# Altium schematic sheet mcu.SchDoc
size A4; SheetNumber: 1; SheetTotal: 4
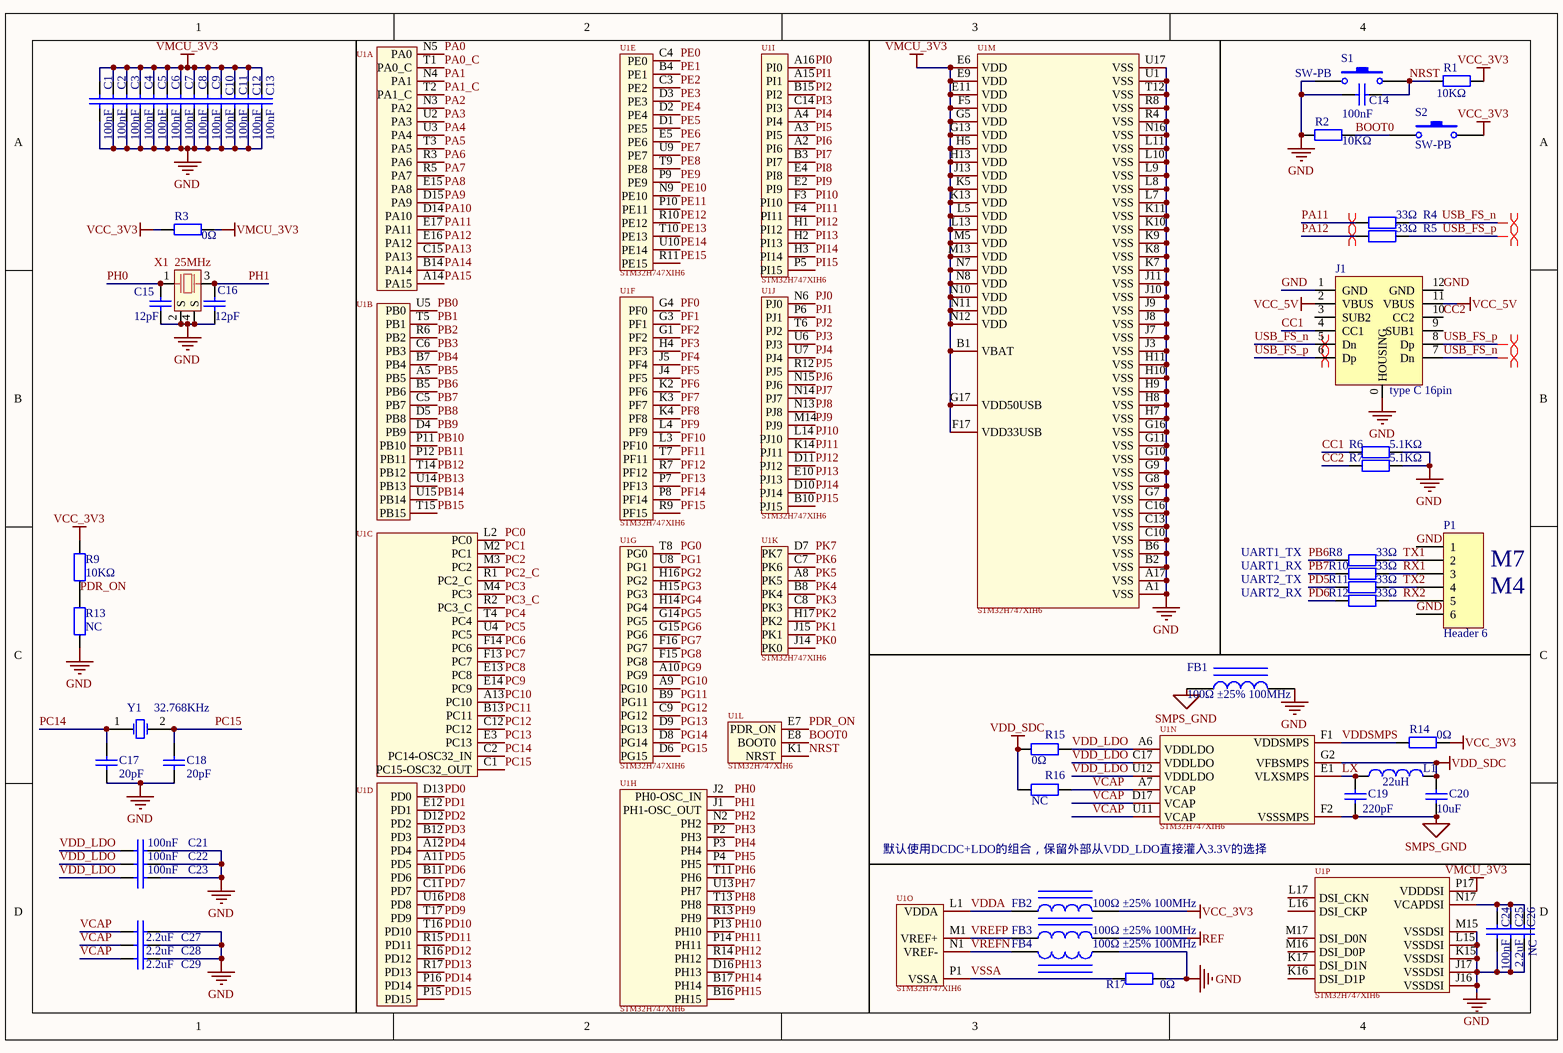
[diagram p0: mcu.SchDoc]

## Parts
(Parts that share a designator on the sheet are numbered #1, #2 ... from top to bottom, then left to right.)
C1  100nF  [0201]
C2  100nF  [0201]
C3  100nF  [0201]
C4  100nF  [0201]
C5  100nF  [0201]
C6  100nF  [0201]
C7  100nF  [0201]
C8  100nF  [0201]
C9  100nF  [0201]
C10  100nF  [0201]
C11  100nF  [0201]
C12  100nF  [0201]
C13  100nF  [0201]
C14  100nF  [0402_C]
C15  12pF  [0402_C]
C16  12pF  [0402_C]
C17  20pF  [0402_C]
C18  20pF  [0402_C]
C19  220pF  [0402_C]
C20  10uF  [0603_C]
C21  100nF  [0402_C]
C22  100nF  [0402_C]
C23  100nF  [0402_C]
C24  100nF  [0402_C]
C25  2.2uF  [0402_C]
C26  NC  [0402_C]
C27  2.2uF  [0402_C]
C28  2.2uF  [0402_C]
C29  2.2uF  [0402_C]
FB1  100Ω ±25% 100MHz  [0805_L]
FB2  100Ω ±25% 100MHz  [0805_L]
FB3  100Ω ±25% 100MHz  [0805_L]
FB4  100Ω ±25% 100MHz  [0805_L]
J1  type C 16pin  [USB type C  16pin]
L1  value 22uH  [IND-SMD_L2.5-W2.0_YXMBL252010P]  (hidden comment: Inductor)
P1  Header 6  [HDR1X6]
R1  10KΩ  [0402_R]
R2  10KΩ  [0402_R]
R3  0Ω  [0402_R]
R4  33Ω  [0402_R]
R5  33Ω  [0402_R]
R6  5.1KΩ  [0402_R]
R7  5.1KΩ  [0402_R]
R8  33Ω  [0805_R]
R9  10KΩ  [0402_R]
R10  33Ω  [0805_R]
R11  33Ω  [0805_R]
R12  33Ω  [0805_R]
R13  NC  [0402_R]
R14  0Ω  [0402_R]
R15  0Ω  [0805_R]
R16  NC  [0805_R]
R17  0Ω  [0402_R]
S1  SW-PB  [SW-3*4-2P]
S2  SW-PB  [SW-3*4-2P]
U1#1  STM32H747XIH6  [TFBGA-265_L14.0-W14.0-P0.80-TL_STM32H743XIH6]  (value not drawn)  (parts A,B,C,D,E,F,G,H,I,J,K of 13)
U1#2  STM32H747XIH6  [TFBGA-265_L14.0-W14.0-P0.80-TL_STM32H743XIH6]  (parts L,M,N,O,P of 16)
X1  25MHz  [3225]
Y1  32.768KHz  [SMD-3215_2P FC - 135]

## Nets
GND: C1.1 C2.1 C3.1 C4.1 C5.1 C6.1 C7.1 C8.1 C9.1 C10.1 C11.1 C12.1 C13.1 C14.1 C15.2 C16.2 C17.1 C18.1 C21.2 C22.2 C23.2 C24.1 C25.1 C26.1 C27.2 C28.2 C29.2 FB1.2 FB4.2 J1.0(HOUSING) J1.1(GND) J1.12(GND) P1.1 P1.6 R2.1 R6.2 R7.2 R13.1 R17.1 S1.1 U1#2.A1(VSS) U1#2.A17(VSS) U1#2.B2(VSS) U1#2.B6(VSS) U1#2.C10(VSS) U1#2.C13(VSS) U1#2.C16(VSS) U1#2.G7(VSS) U1#2.G8(VSS) U1#2.G9(VSS) U1#2.G10(VSS) U1#2.G11(VSS) U1#2.G16(VSS) U1#2.H7(VSS) U1#2.H8(VSS) U1#2.H9(VSS) U1#2.H10(VSS) U1#2.H11(VSS) U1#2.J3(VSS) U1#2.J7(VSS) U1#2.J8(VSS) U1#2.J9(VSS) U1#2.J10(VSS) U1#2.J11(VSS) U1#2.J16(VSSDSI) U1#2.J17(VSSDSI) U1#2.K7(VSS) U1#2.K8(VSS) U1#2.K9(VSS) U1#2.K10(VSS) U1#2.K11(VSS) U1#2.K15(VSSDSI) U1#2.L7(VSS) U1#2.L8(VSS) U1#2.L9(VSS) U1#2.L10(VSS) U1#2.L11(VSS) U1#2.L15(VSSDSI) U1#2.M15(VSSDSI) U1#2.N16(VSS) U1#2.R4(VSS) U1#2.R8(VSS) U1#2.T12(VSS) U1#2.U1(VSS) U1#2.U17(VSS) X1.2(S) X1.4(S)
REF: FB3.2
SMPS_GND: C19.1 C20.1 FB1.1 U1#2.F2(VSSSMPS)
VCC_3V3: FB2.2 R1.2 R3.1 R9.2 R14.1 S2.2
VCC_5V: J1.2(VBUS) J1.11(VBUS)
VDD_SDC: C20.2 L1.2 R15.2 R16.2 U1#2.G2(VFBSMPS)
VMCU_3V3: C1.2 C2.2 C3.2 C4.2 C5.2 C6.2 C7.2 C8.2 C9.2 C10.2 C11.2 C12.2 C13.2 R3.2 U1#2.B1(VBAT) U1#2.E6(VDD) U1#2.E9(VDD) U1#2.E11(VDD) U1#2.F5(VDD) U1#2.F17(VDD33USB) U1#2.G5(VDD) U1#2.G13(VDD) U1#2.G17(VDD50USB) U1#2.H5(VDD) U1#2.H13(VDD) U1#2.J13(VDD) U1#2.K5(VDD) U1#2.K13(VDD) U1#2.L5(VDD) U1#2.L13(VDD) U1#2.M5(VDD) U1#2.M13(VDD) U1#2.N7(VDD) U1#2.N8(VDD) U1#2.N10(VDD) U1#2.N11(VDD) U1#2.N12(VDD) U1#2.P17(VDDDSI)
BOOT0: R2.2 S2.1 U1#2.E8(BOOT0)
CC1: J1.4(CC1) R6.1
CC2: J1.10(CC2) R7.1
LX: C19.2 L1.1 U1#2.E1(VLXSMPS)
NRST: C14.2 R1.1 S1.2 U1#2.K1(NRST)
PA0: U1#1.N5(PA0)
PA0_C: U1#1.T1(PA0_C)
PA1: U1#1.N4(PA1)
PA1_C: U1#1.T2(PA1_C)
PA2: U1#1.N3(PA2)
PA3: U1#1.U2(PA3)
PA4: U1#1.U3(PA4)
PA5: U1#1.T3(PA5)
PA6: U1#1.R3(PA6)
PA7: U1#1.R5(PA7)
PA8: U1#1.E15(PA8)
PA9: U1#1.D15(PA9)
PA10: U1#1.D14(PA10)
PA11: R4.1 U1#1.E17(PA11)
PA12: R5.1 U1#1.E16(PA12)
PA13: U1#1.C15(PA13)
PA14: U1#1.B14(PA14)
PA15: U1#1.A14(PA15)
PB0: U1#1.U5(PB0)
PB1: U1#1.T5(PB1)
PB2: U1#1.R6(PB2)
PB3: U1#1.C6(PB3)
PB4: U1#1.B7(PB4)
PB5: U1#1.A5(PB5)
PB6: R8.1 U1#1.B5(PB6)
PB7: R10.1 U1#1.C5(PB7)
PB8: U1#1.D5(PB8)
PB9: U1#1.D4(PB9)
PB10: U1#1.P11(PB10)
PB11: U1#1.P12(PB11)
PB12: U1#1.T14(PB12)
PB13: U1#1.U14(PB13)
PB14: U1#1.U15(PB14)
PB15: U1#1.T15(PB15)
PC0: U1#1.L2(PC0)
PC1: U1#1.M2(PC1)
PC2: U1#1.M3(PC2)
PC2_C: U1#1.R1(PC2_C)
PC3: U1#1.M4(PC3)
PC3_C: U1#1.R2(PC3_C)
PC4: U1#1.T4(PC4)
PC5: U1#1.U4(PC5)
PC6: U1#1.F14(PC6)
PC7: U1#1.F13(PC7)
PC8: U1#1.E13(PC8)
PC9: U1#1.E14(PC9)
PC10: U1#1.A13(PC10)
PC11: U1#1.B13(PC11)
PC12: U1#1.C12(PC12)
PC13: U1#1.E3(PC13)
PC14: C17.2 U1#1.C2(PC14-OSC32_IN) Y1.1(OSC1)
PC15: C18.2 U1#1.C1(PC15-OSC32_OUT) Y1.2(OSC2)
PD0: U1#1.D13(PD0)
PD1: U1#1.E12(PD1)
PD2: U1#1.D12(PD2)
PD3: U1#1.B12(PD3)
PD4: U1#1.A12(PD4)
PD5: R11.1 U1#1.A11(PD5)
PD6: R12.1 U1#1.B11(PD6)
PD7: U1#1.C11(PD7)
PD8: U1#1.U16(PD8)
PD9: U1#1.T17(PD9)
PD10: U1#1.T16(PD10)
PD11: U1#1.R15(PD11)
PD12: U1#1.R16(PD12)
PD13: U1#1.R17(PD13)
PD14: U1#1.P16(PD14)
PD15: U1#1.P15(PD15)
PDR_ON: R9.1 R13.2 U1#2.E7(PDR_ON)
PE0: U1#1.C4(PE0)
PE1: U1#1.B4(PE1)
PE2: U1#1.C3(PE2)
PE3: U1#1.D3(PE3)
PE4: U1#1.D2(PE4)
PE5: U1#1.D1(PE5)
PE6: U1#1.E5(PE6)
PE7: U1#1.U9(PE7)
PE8: U1#1.T9(PE8)
PE9: U1#1.P9(PE9)
PE10: U1#1.N9(PE10)
PE11: U1#1.P10(PE11)
PE12: U1#1.R10(PE12)
PE13: U1#1.T10(PE13)
PE14: U1#1.U10(PE14)
PE15: U1#1.R11(PE15)
PF0: U1#1.G4(PF0)
PF1: U1#1.G3(PF1)
PF2: U1#1.G1(PF2)
PF3: U1#1.H4(PF3)
PF4: U1#1.J5(PF4)
PF5: U1#1.J4(PF5)
PF6: U1#1.K2(PF6)
PF7: U1#1.K3(PF7)
PF8: U1#1.K4(PF8)
PF9: U1#1.L4(PF9)
PF10: U1#1.L3(PF10)
PF11: U1#1.T7(PF11)
PF12: U1#1.R7(PF12)
PF13: U1#1.P7(PF13)
PF14: U1#1.P8(PF14)
PF15: U1#1.R9(PF15)
PG0: U1#1.T8(PG0)
PG1: U1#1.U8(PG1)
PG2: U1#1.H16(PG2)
PG3: U1#1.H15(PG3)
PG4: U1#1.H14(PG4)
PG5: U1#1.G14(PG5)
PG6: U1#1.G15(PG6)
PG7: U1#1.F16(PG7)
PG8: U1#1.F15(PG8)
PG9: U1#1.A10(PG9)
PG10: U1#1.A9(PG10)
PG11: U1#1.B9(PG11)
PG12: U1#1.C9(PG12)
PG13: U1#1.D9(PG13)
PG14: U1#1.D8(PG14)
PG15: U1#1.D6(PG15)
PH0: C15.1 U1#1.J2(PH0-OSC_IN) X1.1
PH1: C16.1 U1#1.J1(PH1-OSC_OUT) X1.3
PH2: U1#1.N2(PH2)
PH3: U1#1.P2(PH3)
PH4: U1#1.P3(PH4)
PH5: U1#1.P4(PH5)
PH6: U1#1.T11(PH6)
PH7: U1#1.U13(PH7)
PH8: U1#1.T13(PH8)
PH9: U1#1.R13(PH9)
PH10: U1#1.P13(PH10)
PH11: U1#1.P14(PH11)
PH12: U1#1.R14(PH12)
PH13: U1#1.D16(PH13)
PH14: U1#1.B17(PH14)
PH15: U1#1.B16(PH15)
PI0: U1#1.A16(PI0)
PI1: U1#1.A15(PI1)
PI2: U1#1.B15(PI2)
PI3: U1#1.C14(PI3)
PI4: U1#1.A4(PI4)
PI5: U1#1.A3(PI5)
PI6: U1#1.A2(PI6)
PI7: U1#1.B3(PI7)
PI8: U1#1.E4(PI8)
PI9: U1#1.E2(PI9)
PI10: U1#1.F3(PI10)
PI11: U1#1.F4(PI11)
PI12: U1#1.H1(PI12)
PI13: U1#1.H2(PI13)
PI14: U1#1.H3(PI14)
PI15: U1#1.P5(PI15)
PJ0: U1#1.N6(PJ0)
PJ1: U1#1.P6(PJ1)
PJ2: U1#1.T6(PJ2)
PJ3: U1#1.U6(PJ3)
PJ4: U1#1.U7(PJ4)
PJ5: U1#1.R12(PJ5)
PJ6: U1#1.N15(PJ6)
PJ7: U1#1.N14(PJ7)
PJ8: U1#1.N13(PJ8)
PJ9: U1#1.M14(PJ9)
PJ10: U1#1.L14(PJ10)
PJ11: U1#1.K14(PJ11)
PJ12: U1#1.D11(PJ12)
PJ13: U1#1.E10(PJ13)
PJ14: U1#1.D10(PJ14)
PJ15: U1#1.B10(PJ15)
PK0: U1#1.J14(PK0)
PK1: U1#1.J15(PK1)
PK2: U1#1.H17(PK2)
PK3: U1#1.C8(PK3)
PK4: U1#1.B8(PK4)
PK5: U1#1.A8(PK5)
PK6: U1#1.C7(PK6)
PK7: U1#1.D7(PK7)
RX1: P1.3 R10.2
RX2: P1.5 R12.2
TX1: P1.2 R8.2
TX2: P1.4 R11.2
USB_FS_n: J1.5(Dn) J1.7(Dn) R4.2
USB_FS_p: J1.6(Dp) J1.8(Dp) R5.2
VCAP: C27.1 C28.1 C29.1 R16.1 U1#2.A7(VCAP) U1#2.D17(VCAP) U1#2.U11(VCAP)
VDD_LDO: C21.1 C22.1 C23.1 R15.1 U1#2.A6(VDDLDO) U1#2.C17(VDDLDO) U1#2.U12(VDDLDO)
VDDA: FB2.1 U1#2.L1(VDDA)
VDDSMPS: R14.2 U1#2.F1(VDDSMPS)
VREFN: FB4.1 U1#2.N1(VREF-)
VREFP: FB3.1 U1#2.M1(VREF+)
VSSA: R17.2 U1#2.P1(VSSA)
NetC24_2: C24.2 C25.2 C26.2 U1#2.N17(VCAPDSI)

Not connected (* = marked no-connect by the designer): J1 3(SUB2) 9(SUB1); U1#2 K16(DSI_D1P) K17(DSI_D1N) L16(DSI_CKP) L17(DSI_CKN) M16(DSI_D0P) M17(DSI_D0N)

## Layout directives
differential pair: PA11, PA12, USB_FS_n, USB_FS_p

## Notes on the sheet
- UART1_TX
- UART1_RX
- UART2_TX
- (near P1) M7
- UART2_RX
- (near P1) M4
- (near U1#2) 默认使用DCDC+LDO的组合，保留外部从VDD_LDO直接灌入3.3V的选择

## Library data of the parts
C1-C14 C21-C24 = 0402 100nF (104) 10% 16V: 贴片电容; ComponentLink1Description: 供应商链接; ComponentLink1URL: http://www.szlcsc.com/product/details_1877.html; Package: 0402; Supplier: LC; SuppliersPartNumber: C1525
C15-C18 = 0402 20pF (200) 5% 50V: 贴片电容; ComponentLink1Description: 供应商链接; ComponentLink1URL: http://www.szlcsc.com/product/details_1906.html; Package: 0402; Supplier: LC; SuppliersPartNumber: C1554
C19 = 0402 220pF (221) 10% 50V: 贴片电容; ComponentLink1Description: 供应商链接; ComponentLink1URL: http://www.szlcsc.com/product/details_1882.html; Package: 0402; Supplier: LC; SuppliersPartNumber: C1530
C20 = 0603 10uF (106) 10% 10V: 贴片电容; ComponentLink1Description: 供应商链接; ComponentLink1URL: http://www.szlcsc.com/product/details_20411.html; Package: 0603; Supplier: LC; SuppliersPartNumber: C19702
C25 C26 = 0402 2.2nF (222) 10% 50V: 贴片电容; ComponentLink1Description: 供应商链接; ComponentLink1URL: http://www.szlcsc.com/product/details_1883.html; Package: 0402; Supplier: LC; SuppliersPartNumber: C1531
C27-C29 = 0402 1.0uF (105) 10% 25V: 贴片电容; ComponentLink1Description: 供应商链接; ComponentLink1URL: http://www.szlcsc.com/product/details_53938.html; Package: 0402; Supplier: LC; SuppliersPartNumber: C52923
FB1-FB4 = 0805 100Ω 25% 100MHz: 贴片磁珠; ComponentLink1Description: 供应商链接; ComponentLink1URL: http://www.szlcsc.com/product/details_1367.html; Package: 0805; Supplier: LC; SuppliersPartNumber: C1015
J1 = USB type C 16pin: 16针脚C口
L1 = Inductor: Code_IEC: 1005; Published: 8-Jun-2000; LatestRevisionDate: 29-May-2009; LatestRevisionNote: IPC-7351 Footprint Added.; PackageReference: 0402-A; Publisher: Altium Limited; PackageDescription: Chip Inductor; Code_JEITA: 0402
P1 = Header 6: Header, 6-Pin; LatestRevisionDate: 17-Jul-2002; LatestRevisionNote: Re-released for DXP Platform.; Publisher: Altium Limited
R1 R2 R9 R13 = 0402 10KΩ (1002) 1%: 贴片电阻; ComponentLink1Description: 供应商链接; ComponentLink1URL: http://www.szlcsc.com/product/details_26487.html; Package: 0402; Supplier: LC; SuppliersPartNumber: C25744
R3 R14-R17 = 0402 0Ω (0R0) 1%: 贴片电阻; ComponentLink1Description: 供应商链接; ComponentLink1URL: http://www.szlcsc.com/product/details_17853.html; Package: 0402; Supplier: LC; SuppliersPartNumber: C17168
R4 R5 R8 R10-R12 = 0402 33Ω (33R0) 1%: 贴片电阻; ComponentLink1Description: 供应商链接; ComponentLink1URL: http://www.szlcsc.com/product/details_25848.html; Package: 0402; Supplier: LC; SuppliersPartNumber: C25105
R6 R7 = 0402 5.1KΩ (5101) 1%: 贴片电阻; ComponentLink1Description: 供应商链接; ComponentLink1URL: http://www.szlcsc.com/product/details_26648.html; Package: 0402; Supplier: LC; SuppliersPartNumber: C25905
S1 S2 = SW-PB: Switch; Published: 24-Mar-1999; LatestRevisionDate: 17-Jul-2002; LatestRevisionNote: Re-released for DXP Platform.; PackageReference: SPST-2; Publisher: Altium Limited; PackageDescription: Switch; 2 Leads
U1#1 U1#2 = STM32H747XIH6: 双核MCU; Manufacturer: ST(意法半导体); Add into BOM: yes; Symbol: STM32H747XIH6; Device: STM32H747XIH6; LCSC Part Name: 带DSP和DP-FPU的高性能ARM Cortex-M7 + Cortex-M4 MCU，具有2 MB Flash、1 MB RAM、480 MHz CPU、ART加速器、一级缓存、外部存储器接口、大量外设、SMPS和MIPI-DSI; Supplier Part: C5271089; Manufacturer Part: STM32H747XIH6; Supplier Footprint: TFBGA-265(14x14); JLCPCB Part Class: Extended Part; Datasheet: https://atta.szlcsc.com/upload/public/pdf/source/20230906/B22899485390F262A37AA3B845B2D1AE.pdf; Supplier: LCSC; Convert to PCB: yes
X1 = 四脚无源晶体: 4脚贴片无源晶体; Manufacturer: YJX(雅晶鑫); Symbol: TAXM8M4RDBCCT2T; Add into BOM: yes; Value: 8MHz; Normal temperature Frequency Tolerance: ±10ppm; Load Capacitance: 10pF; Frequency Stability: ±15ppm; Equivalent Series Resistance(ESR): 250Ω; Device: TAXM8M4RDBCCT2T; LCSC Part Name: 8MHz ±10ppm 10pF; Supplier Part: C400090; Manufacturer Part: TAXM8M4RDBCCT2T; Supplier Footprint: SMD3225-4P; JLCPCB Part Class: Extended Part; Datasheet: https://atta.szlcsc.com/upload/public/pdf/source/20190626/C400090_CF95B89E745AFE4EF2E392EF8AC009D6.pdf; Supplier: LCSC; Convert to PCB: yes; Type: 贴片晶振; Operating Temperature: -40℃~+85℃
Y1 = SMD-3215_2P 32.768KHz 20ppm 12.5pF: 贴片晶振; ComponentLink1Description: 供应商链接; ComponentLink1URL: http://www.szlcsc.com/product/details_33310.html; Package: SMD-3215_2P; Supplier: LC; SuppliersPartNumber: C32346